# Altium schematic sheet EMMC_NANDFLASH_BGA153.SchDoc
size A3; SheetNumber: 18; SheetTotal: 22
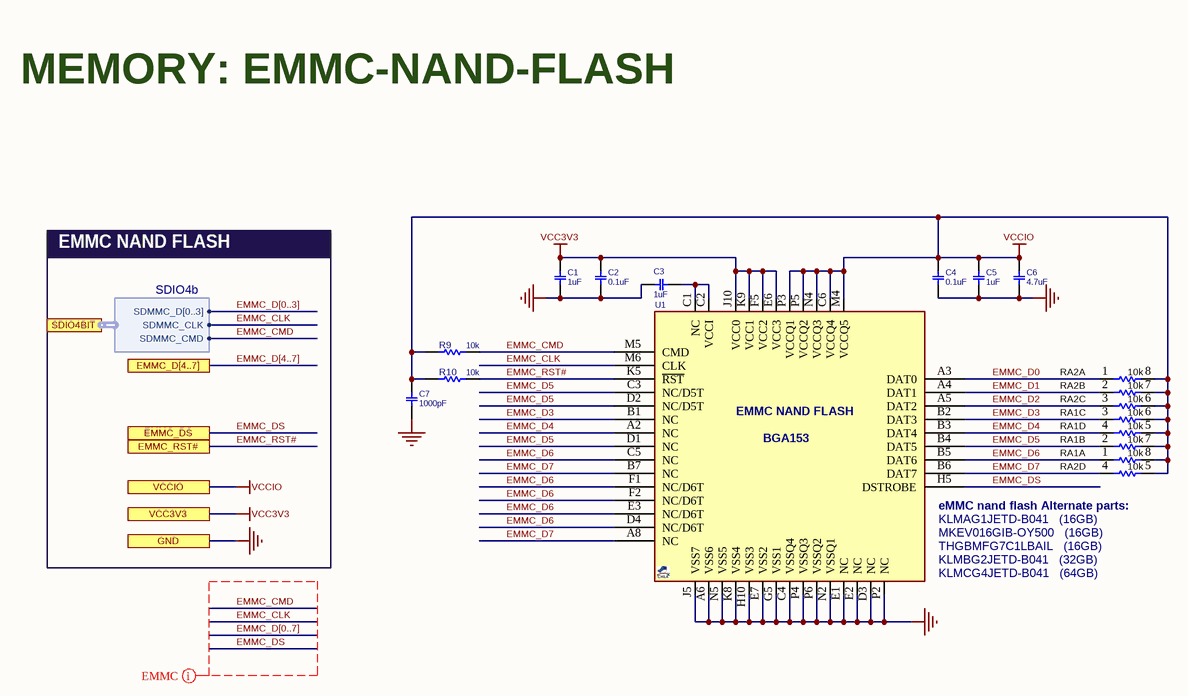
[diagram p0: EMMC_NANDFLASH_BGA153.SchDoc]

## Parts
C1  1uF  [C0402]
C2  0.1uF  [C0402]
C3  1uF  [C0402]
C4  0.1uF  [C0402]
C5  1uF  [C0402]
C6  4.7uF  [C0402]
C7  1000pF  [C0402]
R9  10k  [R0402]
R10  10k  [R0402]
RA1  10k  [RP0402X4A]  (parts A,B,C,D of 4)
RA2  10k  [RP0402X4A]  (parts A,B,C,D of 4)
U1  eMMC_16GB  [BGA50_153_EMMC]  (value not drawn)

## Ports
EMMC_D[4..7], EMMC_DS, EMMC_RST#, GND, SDIO4BIT (harness SDIO4b), VCC3V3, VCCIO

## Harnesses
SDIO4b: SDMMC_CMD, SDMMC_D[0..3], SDMMC_CLK

## Nets
GND: C1.1 C2.1 C3.1 C4.1 C5.1 C6.1 C7.1 U1.A6(VSS6) U1.C4(VSSQ4) U1.D3(NC) U1.E1(NC) U1.E2(NC) U1.E7(VSS2) U1.G5(VSS1) U1.H10(VSS3) U1.J5(VSS7) U1.K8(VSS4) U1.N2(VSSQ1) U1.N5(VSS5) U1.P2(NC) U1.P4(VSSQ3) U1.P6(VSSQ2) ; port GND
VCC3V3: C1.2 C2.2 U1.E6(VCC3) U1.F5(VCC2) U1.J10(VCC0) U1.K9(VCC1) ; port VCC3V3
VCCIO: C4.2 C5.2 C6.2 C7.2 R9.2 R10.2 RA1.5 RA1.6 RA1.7 RA1.8 RA2.5 RA2.6 RA2.7 RA2.8 U1.C6(VCCQ4) U1.M4(VCCQ5) U1.N4(VCCQ3) U1.P3(VCCQ1) U1.P5(VCCQ2) ; port VCCIO
EMMC_CLK: U1.M6(CLK) ; port SDIO4BIT.SDMMC_CLK
EMMC_CMD: R9.1 U1.M5(CMD) ; port SDIO4BIT.SDMMC_CMD
EMMC_D0: RA2.1 U1.A3(DAT0)
EMMC_D1: RA2.2 U1.A4(DAT1)
EMMC_D2: RA2.3 U1.A5(DAT2)
EMMC_D3: RA1.3 U1.B1(NC) U1.B2(DAT3)
EMMC_D4: RA1.4 U1.A2(NC) U1.B3(DAT4)
EMMC_D5: RA1.2 U1.B4(DAT5) U1.C3(NC/D5T) U1.D1(NC) U1.D2(NC/D5T)
EMMC_D6: RA1.1 U1.B5(DAT6) U1.C5(NC) U1.D4(NC/D6T) U1.E3(NC/D6T) U1.F1(NC/D6T) U1.F2(NC/D6T)
EMMC_D7: RA2.4 U1.A8(NC) U1.B6(DAT7) U1.B7(NC)
EMMC_DS: U1.H5(DSTROBE) ; port EMMC_DS
EMMC_RST#: R10.1 U1.K5(~{RST}) ; port EMMC_RST#
NetC3_2: C3.2 U1.C1(NC) U1.C2(VCCI)

## Buses and harness runs
bus EMMC_D[0..3]
bus EMMC_D[0..7]
bus EMMC_D[4..7] = port EMMC_D[4..7]

## Layout directives
net class EMMC: EMMC_CLK, EMMC_CMD, EMMC_D[0..7], EMMC_DS

## Notes on the sheet
- MEMORY: EMMC-NAND-FLASH
- EMMC NAND FLASH
- (near U1) eMMC nand flash Alternate parts:
- (near U1) KLMAG1JETD-B041   (16GB)
- (near U1) MKEV016GIB-OY500   (16GB)
- (near U1) THGBMFG7C1LBAIL   (16GB)
- (near U1) KLMBG2JETD-B041   (32GB)
- (near U1) KLMCG4JETD-B041   (64GB)
- (in symbol KLMAG2GEAC_16GB_BGA153) EMMC NAND FLASH; BGA153

## Library data of the parts
C1 C3 C5 = CAP_SMD_MLCC: CAP, MLCC; PARAM: X5R, 10%; MANF_P#: GMK105ABJ105KV-F; MANF: Taiyo Yuden; PARAM2: 35v; PRICE: 100: 0.06$; ASSEMBLY: ASSEMBLY; VALUE: 1uF; PACKAGE: 0402
C2 C4 = CAP_SMD_MLCC: CAP, MLCC; PARAM: X7R, 10%, -55~125oC; MANF_P#: GRM155R71H104KE14D; MANF: Murata; PARAM2: 50v; PRICE: 100: 0.018$; ASSEMBLY: ASSEMBLY; VALUE: 0.1uF; PACKAGE: 0402
C6 = CAP_SMD_MLCC: CAP, MLCC; PARAM: X5R, 20%; MANF_P#: LMK105BBJ475MVLF; MANF: Taiyo Yuden; PARAM2: 10v; PRICE: 10,000: $0.034; ASSEMBLY: ASSEMBLY; VALUE: 4.7uF; PACKAGE: 0402
C7 = CAP_SMD_MLCC: CAP, MLCC; PARAM: C0G, 5%; MANF_P#: CC0402JRNPO9BN102; MANF: Yageo; PARAM2: 50v; PRICE: 100: 0.03$; ASSEMBLY: ASSEMBLY; VALUE: 1000pF; PACKAGE: 0402
R9 R10 = RES_SMD: RESISTOR, SMD; PARAM: 0.063W; DESC: DESCRIPTION; DIST#: MOUSER; PARAM2: 1%; MANF_P#: -; MANF: -; ASSEMBLY: ASSEMBLY; PRICE: 100= 0.3$; VALUE: 10k; PACKAGE: 0402
RA1 RA2 = RES_SMD_PACK_X4: RESISTOR, SMD, PACKX4; MANF_P#: MANF_PART#; MANF: MANF; Value: 10k
U1 = KLMAG2GEAC_16GB_BGA153: eMMC NAND FLASH, 16GB, 128Gb (16G x 8), 153-VFBGA; MANF_P#: KLMAG2GEAC-B031; MANF: Samsung; PARAM2: 2.7~3.6V; PARAM: 128Gb (16G x 8); PRICE: 5$; VALUE: eMMC_16GB